# EAGLE design isolatedPowerSwitchingModule (EAGLE 6.3)
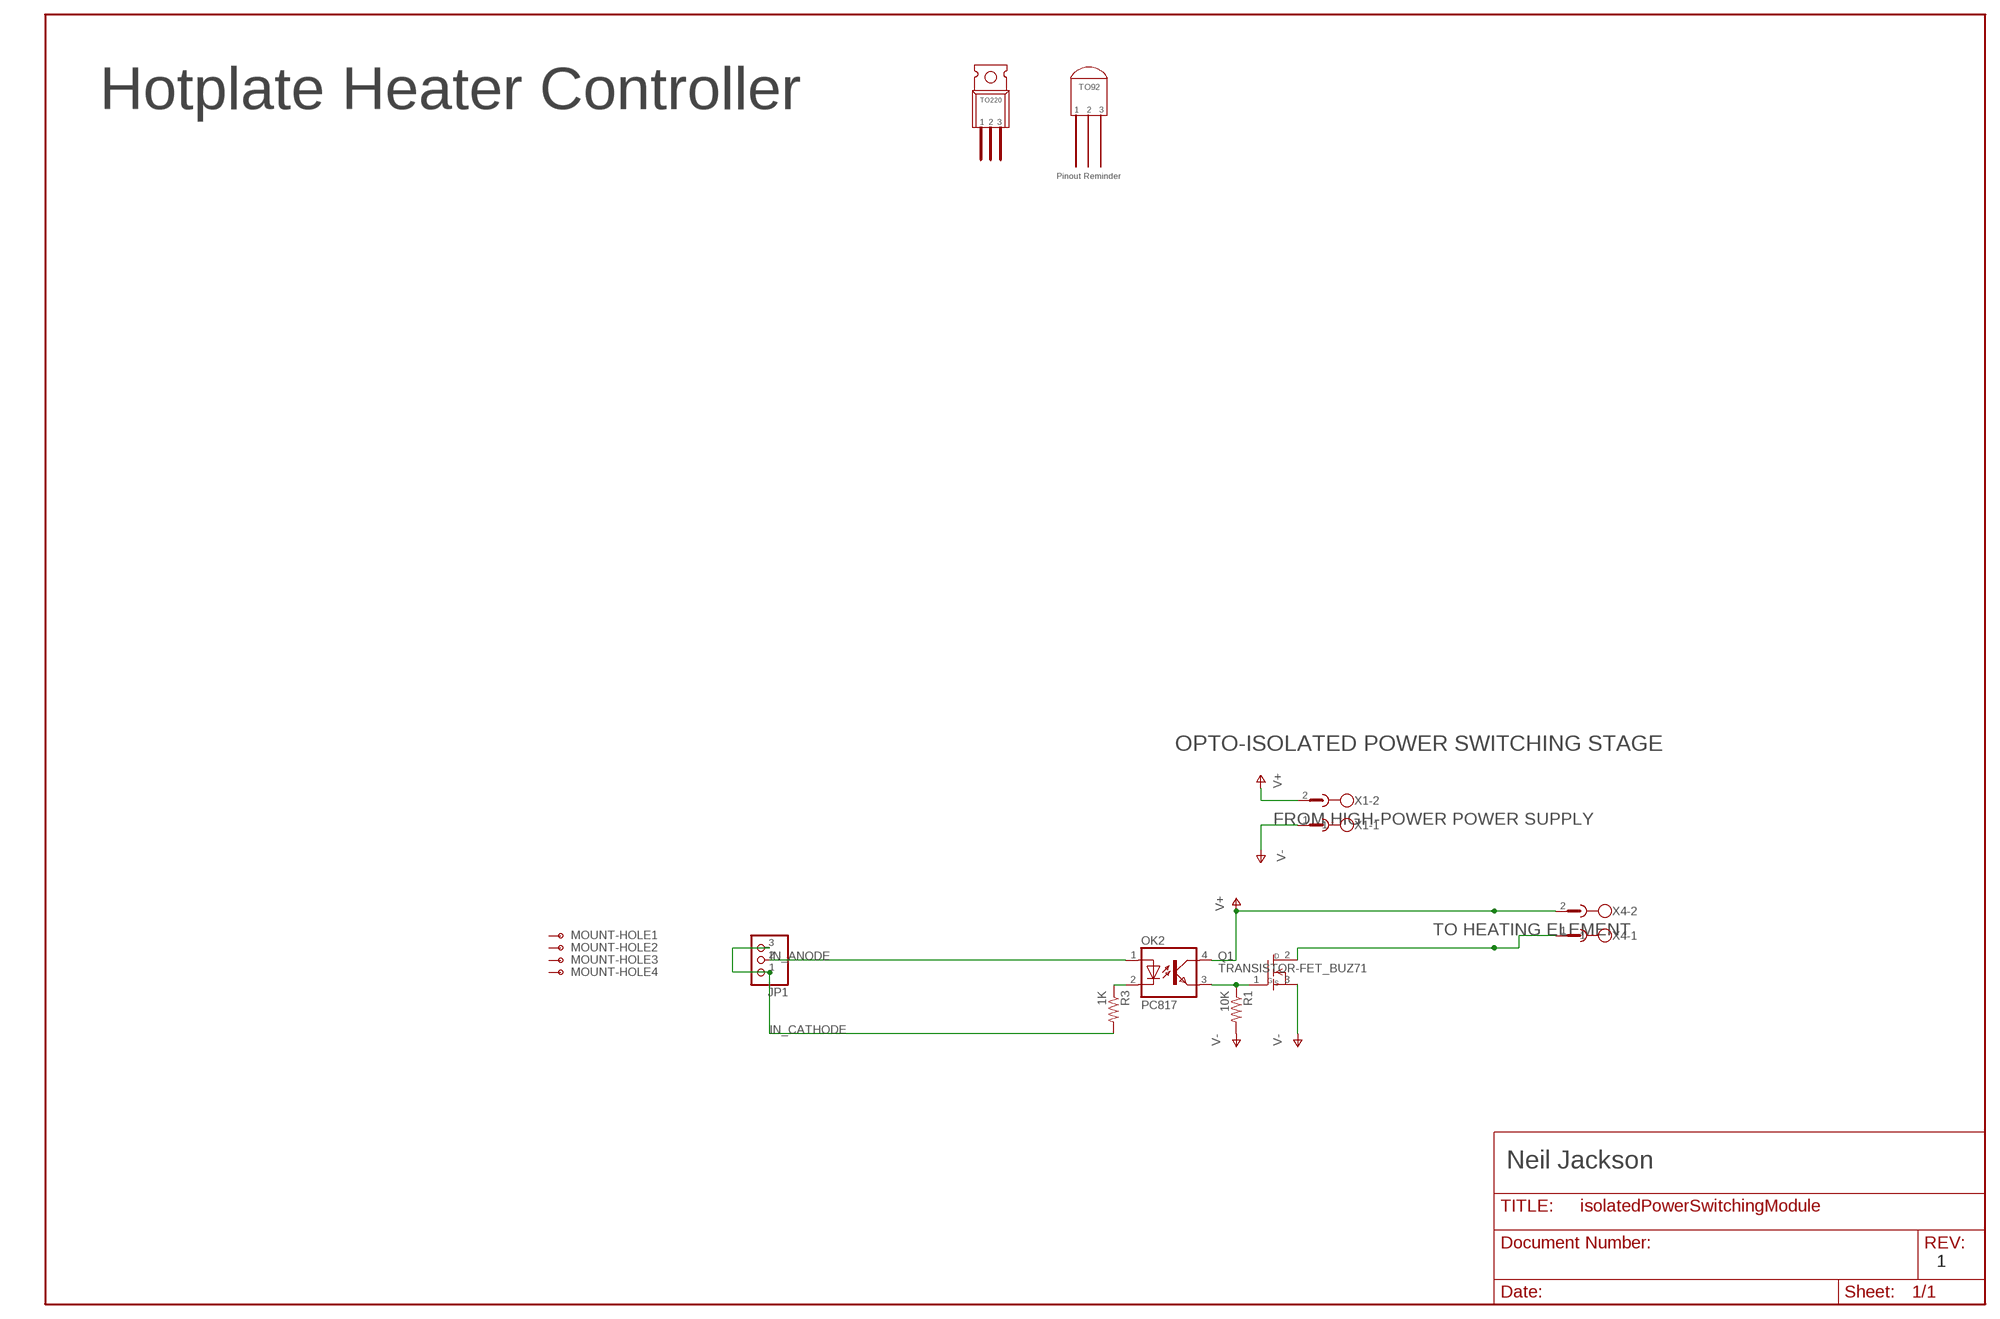
[diagram p0: schematic, sheet 1]

## Parts
JP1  PINHD-1X3  [1X03]
MOUNT-HOLE1  MOUNT-HOLE  [8-32]
MOUNT-HOLE2  MOUNT-HOLE  [8-32]
MOUNT-HOLE3  MOUNT-HOLE  [8-32]
MOUNT-HOLE4  MOUNT-HOLE  [8-32]
OK2  PC817  [DIL04]
Q1  TRANSISTOR-FET_BUZ71  [TRANSISTOR-FET_TO220]
R1  10K  R-US_0207/10  [0207/10]
R3  1K  R-US_0207/10  [0207/10]
X1  PIN_HEADER_2_CONDUCTORRIGHTANGLE  [MSTBA2]
X4  PIN_HEADER_2_CONDUCTORRIGHTANGLE  [MSTBA2]

## Nets
IN_ANODE: JP1.2 OK2.1(A)
IN_CATHODE: JP1.1 JP1.3 R3.2
N$18: Q1.2(D) X4.1
N$20: OK2.3(EMIT) Q1.1(G) R1.1
N$21: OK2.2(C) R3.1
V+: OK2.4(COL) X1.2 X4.2
V-: Q1.3(S) R1.2 X1.1
Unconnected: MOUNT-HOLE1.1(MOUNT_HOLE) MOUNT-HOLE2.1(MOUNT_HOLE) MOUNT-HOLE3.1(MOUNT_HOLE) MOUNT-HOLE4.1(MOUNT_HOLE)

## Notes on the sheet
- Hotplate Heater Controller
- OPTO-ISOLATED POWER SWITCHING STAGE
- FROM HIGH-POWER POWER SUPPLY
- TO HEATING ELEMENT
- Neil Jackson
- 1

## Library data of the parts
JP1 = pinhead:PINHD-1X3: PIN HEADER
MOUNT-HOLE1-MOUNT-HOLE4 = main_library:MOUNT-HOLE
OK2 = optocoupler:PC817: SHARP OPTO COUPLER; MPN: PC817X4J000F; OC_FARNELL: 9707727; OC_NEWARK: 97K7059
Q1 = mosfet:TRANSISTOR-FET_BUZ71: N-Channel Enhancement MOSFET 50V; 14A; 0,1Ohm
R1 R3 = rcl:R-US_: RESISTOR, American symbol
X1 X4 = main_library:PIN_HEADER_2_CONDUCTOR: PHOENIX; AUPN: 6028; INCLUDE_IN_BOM: yes

## Board
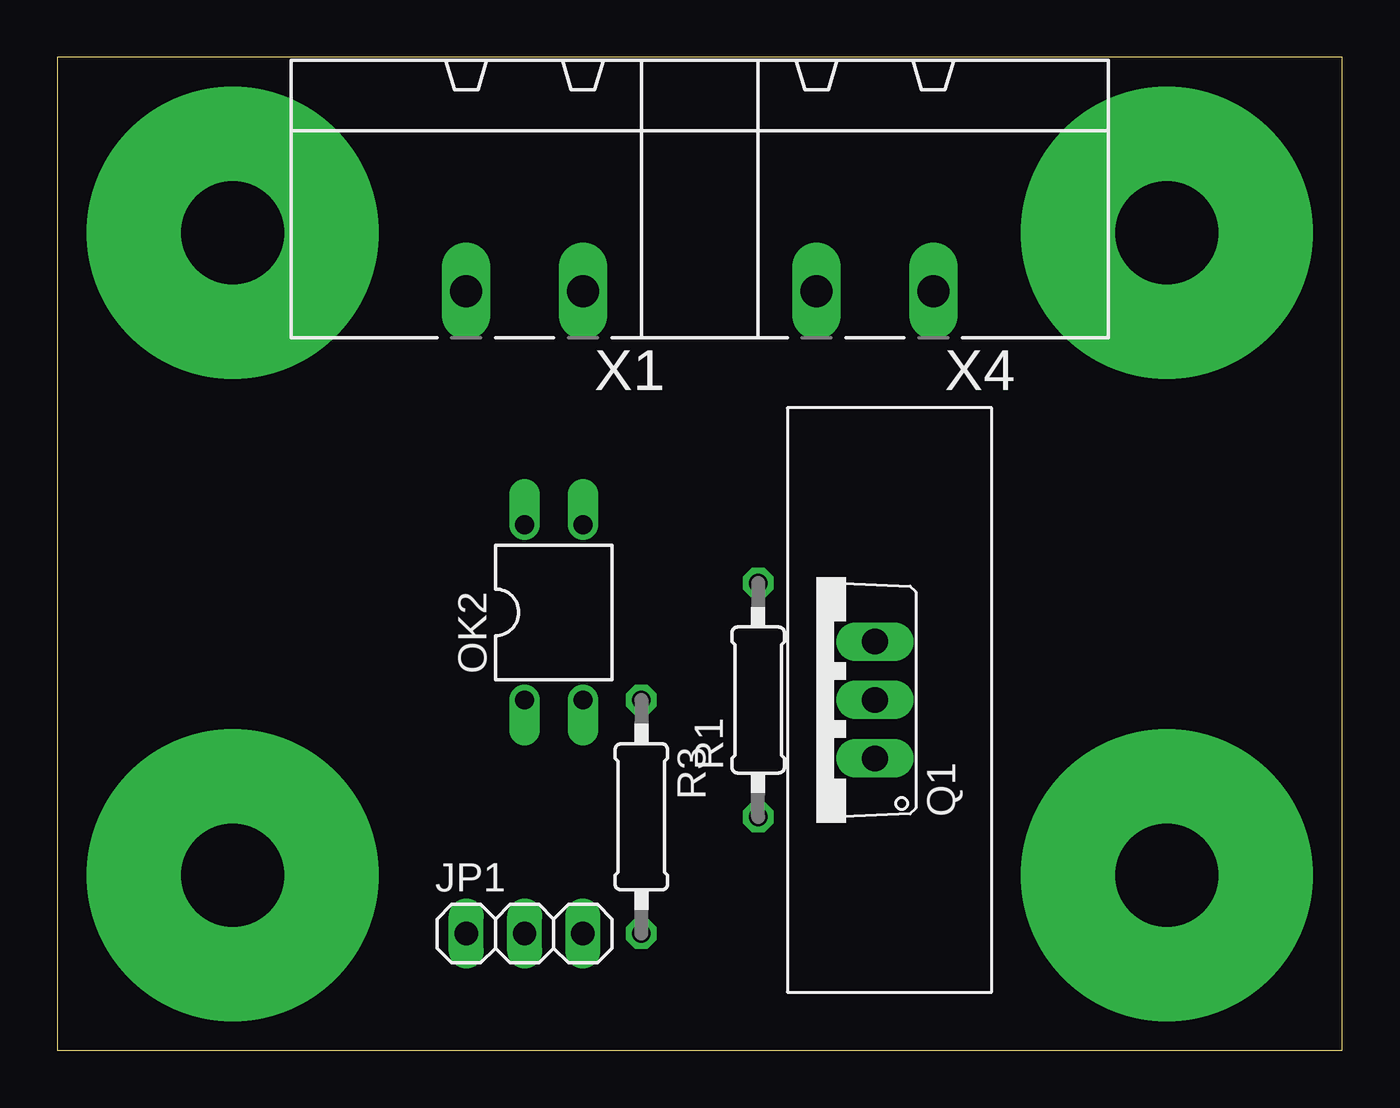
[diagram p1: board, top side]
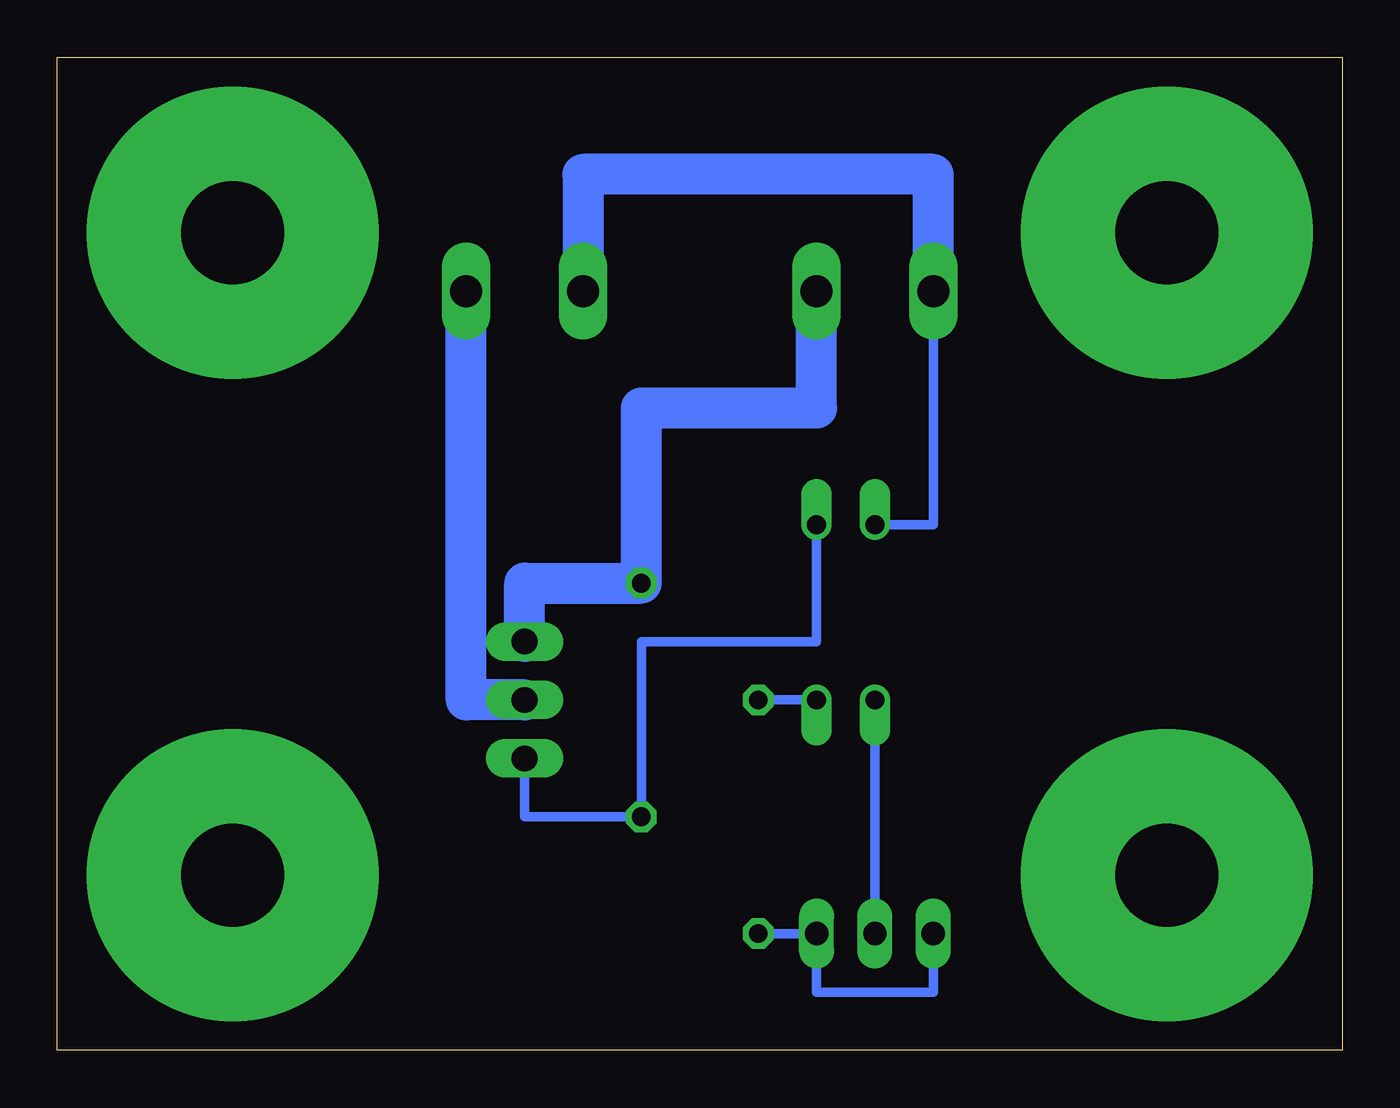
[diagram p2: board, bottom side, seen from below]

Size 55.88 x 43.18 mm. Coordinates in mm from the lower left corner, seen from the top.
Outline: 0,0 55.88,0 55.88,43.18 0,43.18 0,0
Copper layers (1*16): Top 0.035mm / dielectric 1.5mm / Bottom 0.035mm
Design rules "default": minimum track width 10mil, minimum drill 24mil, track to track 8mil, track to pad 8mil, pad to pad 8mil, via to via 8mil, smd to smd 8mil, copper to edge 40mil, drill to drill 8mil, minimum pad ring 10mil, minimum via ring 8mil, stop-mask expansion 4mil, vias tented up to drill 0mil, thermal gap 10mil

### Footprints (pad centres in the part's own frame; a part is rotated, then mirrored left to right if it is on the bottom)
1X03 = drill 1.016 long: 1 -2.54,0; 2 0,0; 3 2.54,0
8-32 = drill 4.496 pad 12.7: 1 0,0
DIL04 = drill 0.813 offset: 1 -1.27,-3.81; 2 1.27,-3.81; 3 1.27,3.81; 4 -1.27,3.81
TRANSISTOR-FET_TO220 = drill 1.118 long: 1 -2.54,0; 2 0,0; 3 2.54,0
0207/10 = drill 0.813 octagon: 1 -5.08,0; 2 5.08,0
MSTBA2 = drill 1.4 long: 1 -2.54,0; 2 2.54,0

### Placement (x,y rotation side)
JP1  20.32,5.08 0 top
MOUNT-HOLE1  7.62,7.62 0 top
MOUNT-HOLE2  48.26,7.62 0 top
MOUNT-HOLE3  7.62,35.56 0 top
MOUNT-HOLE4  48.26,35.56 0 top
OK2  21.59,19.05 0 top
Q1  35.56,15.24 90 top
R1  30.48,15.24 90 top
R3  25.4,10.16 270 top
X1  20.32,33.02 180 top
X4  35.56,33.02 180 top

### Tracks (layer width: path | path; a pad name or v marks a point on that pad's centre or on a via)
IN_ANODE
  Bottom 0.406: OK2.1 JP1.2
IN_CATHODE
  Bottom 0.406: JP1.1 17.78,2.54 22.86,2.54 JP1.3 R3.2
N$18
  Bottom 1.778: Q1.2 38.1,15.24 X4.1
N$20
  Bottom 0.406: Q1.1 35.56,10.16 R1.1 30.48,17.78 22.86,17.78 OK2.3
N$21
  Bottom 0.406: R3.1 OK2.2
V+
  Bottom 0.406: OK2.4 17.78,22.86 X1.2
  Bottom 1.778: X1.2 17.78,38.1 33.02,38.1 X4.2
V-
  Bottom 1.778: Q1.3 35.56,20.32 R1.2 30.48,27.94 22.86,27.94 X1.1